# Altium schematic sheet 06-AUDIO.SchDoc
size A3
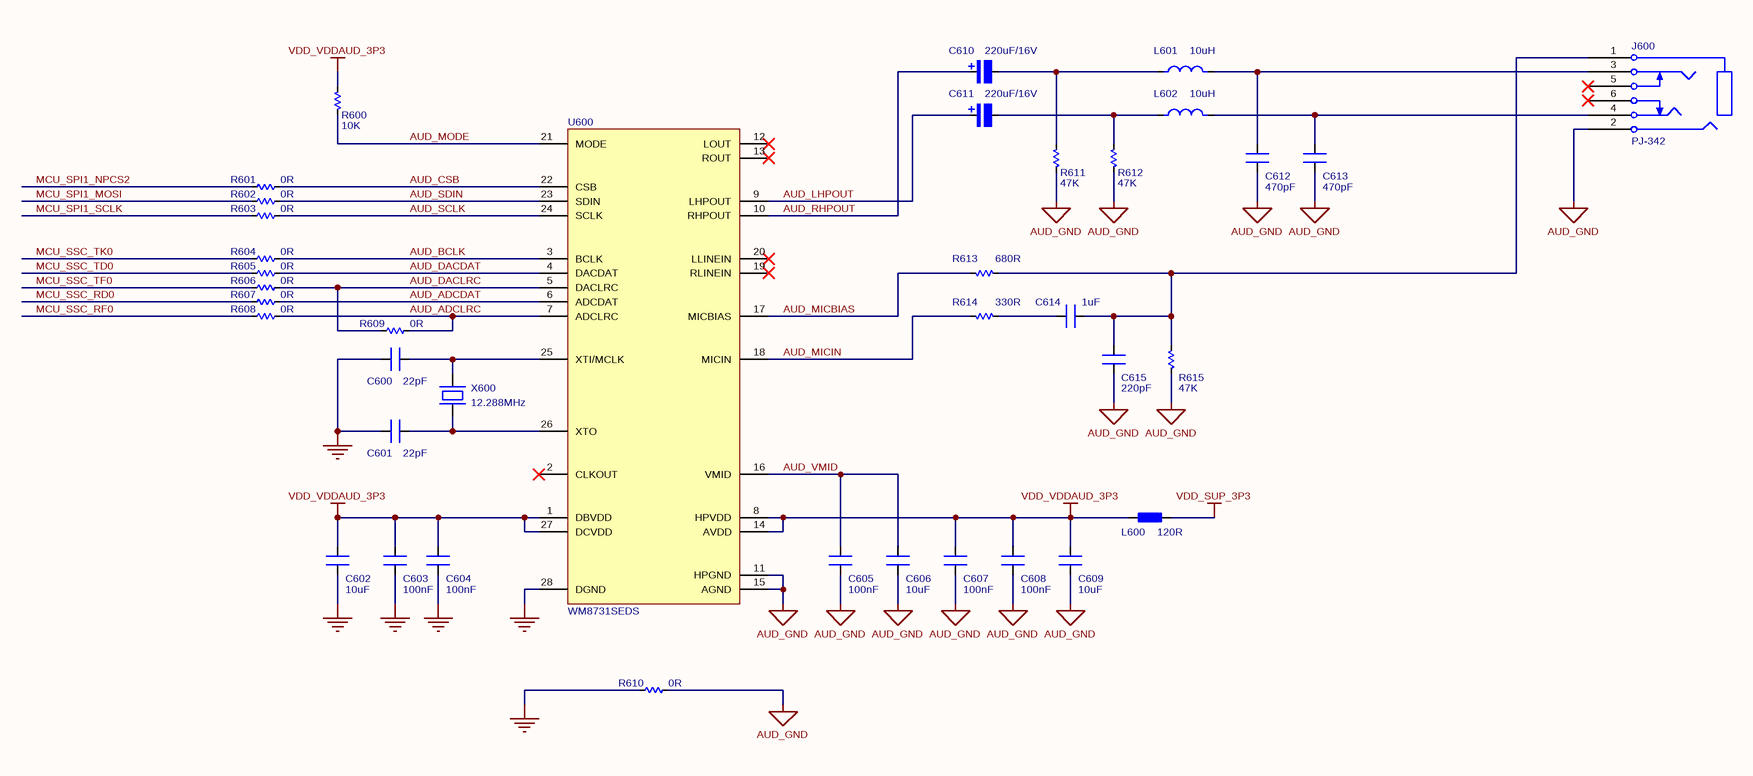
[diagram p0: 06-AUDIO.SchDoc]

## Parts
C600  value 22pF  [CN-SMD-0603]  (hidden comment: Capacitor)
C601  value 22pF  [CN-SMD-0603]  (hidden comment: Capacitor)
C602  value 10uF  [CN-SMD-0603]  (hidden comment: Capacitor)
C603  value 100nF  [CN-SMD-0603]  (hidden comment: Capacitor)
C604  value 100nF  [CN-SMD-0603]  (hidden comment: Capacitor)
C605  value 100nF  [CN-SMD-0603]  (hidden comment: Capacitor)
C606  value 10uF  [CN-SMD-0603]  (hidden comment: Capacitor)
C607  value 100nF  [CN-SMD-0603]  (hidden comment: Capacitor)
C608  value 100nF  [CN-SMD-0603]  (hidden comment: Capacitor)
C609  value 10uF  [CN-SMD-0603]  (hidden comment: Capacitor)
C610  value 220uF/16V  [C-TAL-SMD-3216-18]  (hidden comment: Cap_Tantalum)
C611  value 220uF/16V  [C-TAL-SMD-3216-18]  (hidden comment: Cap_Tantalum)
C612  value 470pF  [CN-SMD-0603]  (hidden comment: Capacitor)
C613  value 470pF  [CN-SMD-0603]  (hidden comment: Capacitor)
C614  value 1uF  [CN-SMD-0603]  (hidden comment: Capacitor)
C615  value 220pF  [CN-SMD-0603]  (hidden comment: Capacitor)
J600  PJ-342  [AUDIO_PJ-342]
L600  value 120R  [L-SMD-0603]  (hidden comment: Ferrite bead)
L601  value 10uH  [L-SMD-0603]  (hidden comment: Inductor)
L602  value 10uH  [L-SMD-0603]  (hidden comment: Inductor)
R600  value 10K  [RES-SMD-0603]  (hidden comment: Resistor)
R601  value 0R  [RES-SMD-0603]  (hidden comment: Resistor)
R602  value 0R  [RES-SMD-0603]  (hidden comment: Resistor)
R603  value 0R  [RES-SMD-0603]  (hidden comment: Resistor)
R604  value 0R  [RES-SMD-0603]  (hidden comment: Resistor)
R605  value 0R  [RES-SMD-0603]  (hidden comment: Resistor)
R606  value 0R  [RES-SMD-0603]  (hidden comment: Resistor)
R607  value 0R  [RES-SMD-0603]  (hidden comment: Resistor)
R608  value 0R  [RES-SMD-0603]  (hidden comment: Resistor)
R609  value 0R  [RES-SMD-0603]  (hidden comment: Resistor)
R610  value 0R  [RES-SMD-0603]  (hidden comment: Resistor)
R611  value 47K  [RES-SMD-0603]  (hidden comment: Resistor)
R612  value 47K  [RES-SMD-0603]  (hidden comment: Resistor)
R613  value 680R  [RES-SMD-0603]  (hidden comment: Resistor)
R614  value 330R  [RES-SMD-0603]  (hidden comment: Resistor)
R615  value 47K  [RES-SMD-0603]  (hidden comment: Resistor)
U600  WM8731SEDS  [SSOP65P780X200-28N]
X600  value 12.288MHz  [XT-SMD-5032-2P]  (hidden comment: Crystal)

## Nets
AUD_GND: C605.1 C606.1 C607.1 C608.1 C609.1 C612.1 C613.1 C615.1 J600.2(GND) R610.1 R611.2 R612.2 R615.2 U600.11(HPGND) U600.15(AGND)
GND: C600.2 C601.2 C602.1 C603.1 C604.1 R610.2 U600.28(DGND)
VDD_SUP_3P3: L600.2
VDD_VDDAUD_3P3: C602.2 C603.2 C604.2 C607.2 C608.2 C609.2 L600.1 R600.1 U600.1(DBVDD) U600.8(HPVDD) U600.14(AVDD) U600.27(DCVDD)
AUD_ADCDAT: R607.1 U600.6(ADCDAT)
AUD_ADCLRC: R608.1 R609.1 U600.7(ADCLRC)
AUD_BCLK: R604.1 U600.3(BCLK)
AUD_CSB: R601.1 U600.22(CSB)
AUD_DACDAT: R605.1 U600.4(DACDAT)
AUD_DACLRC: R606.1 R609.2 U600.5(DACLRC)
AUD_LHPOUT: C611.1 U600.9(LHPOUT)
AUD_MICBIAS: R613.1 U600.17(MICBIAS)
AUD_MICIN: R614.1 U600.18(MICIN)
AUD_MODE: R600.2 U600.21(MODE)
AUD_RHPOUT: C610.1 U600.10(RHPOUT)
AUD_SCLK: R603.1 U600.24(SCLK)
AUD_SDIN: R602.1 U600.23(SDIN)
AUD_VMID: C605.2 C606.2 U600.16(VMID)
MCU_SPI1_MOSI: R602.2
MCU_SPI1_NPCS2: R601.2
MCU_SPI1_SCLK: R603.2
MCU_SSC_RD0: R607.2
MCU_SSC_RF0: R608.2
MCU_SSC_TD0: R605.2
MCU_SSC_TF0: R606.2
MCU_SSC_TK0: R604.2
NetC600_1: C600.1 U600.25(XTI/MCLK) X600.1
NetC601_1: C601.1 U600.26(XTO) X600.2
NetC610_2: C610.2 L601.2 R611.1
NetC611_2: C611.2 L602.2 R612.1
NetC612_2: C612.2 J600.3(RIGHT) L601.1
NetC613_2: C613.2 J600.4(LEFT) L602.1
NetC614_1: C614.1 C615.2 J600.1(MIC) R613.2 R615.1
NetC614_2: C614.2 R614.2

Not connected (* = marked no-connect by the designer): J600 5* 6*; U600 2(CLKOUT)* 12(LOUT)* 13(ROUT)* 19(RLINEIN)* 20(LLINEIN)*

## Library data of the parts
C600 C601 = Cap: Ceramic Capacitor SMD 0603 22pF ±20% 10V
C602 C606 C609 = Cap: Ceramic Capacitor SMD 0603 10uF ±20% 10V
C603-C605 C607 C608 = Cap: Ceramic Capacitor SMD 0603 100nF ±20% 10V
C610 C611 = Cap_Tantalum: Tantalum Capacitor SMD 3216 220uF ±20% 16V
C612 C613 = Cap: Ceramic Capacitor SMD 0603 470pF ±20% 10V
C614 = Cap: Ceramic Capacitor SMD 0603 1uF ±20% 10V
C615 = Cap: Ceramic Capacitor SMD 0603 220pF ±20% 10V
J600 = PJ-342: Audio connector PJ-342 3.5mm 4-pole; Connector type: AUDIO BLACK HEADER; Category: Connector; Status: Production
L600 = Ferrite bead: Ferrite bead SMD 0603 120 Ohm @100MHz
L601 L602 = Inductor: Common Inductor SMD 0603 10uH ±20%
R600 = Res: Resistor SMD 0603 10K 1% 0.1W
R601-R610 = Res: Resistor SMD 0603 0R 1% 0.1W
R611 R612 R615 = Res: Resistor SMD 0603 47K 1% 0.1W
R613 = Res: Resistor SMD 0603 680R 1% 0.1W
R614 = Res: Resistor SMD 0603 330R 1% 0.1W
U600 = WM8731SEDS: Cirrus Logic Portable Internet Audio CODEC with Headphone Driver and Programmable Sample Rates
X600 = XT2: Crystal Oscillator 12.288MHz SMD-5032 2-pin